# EAGLE design spielekonsole_schaltplan_03_05 (EAGLE 6.4)
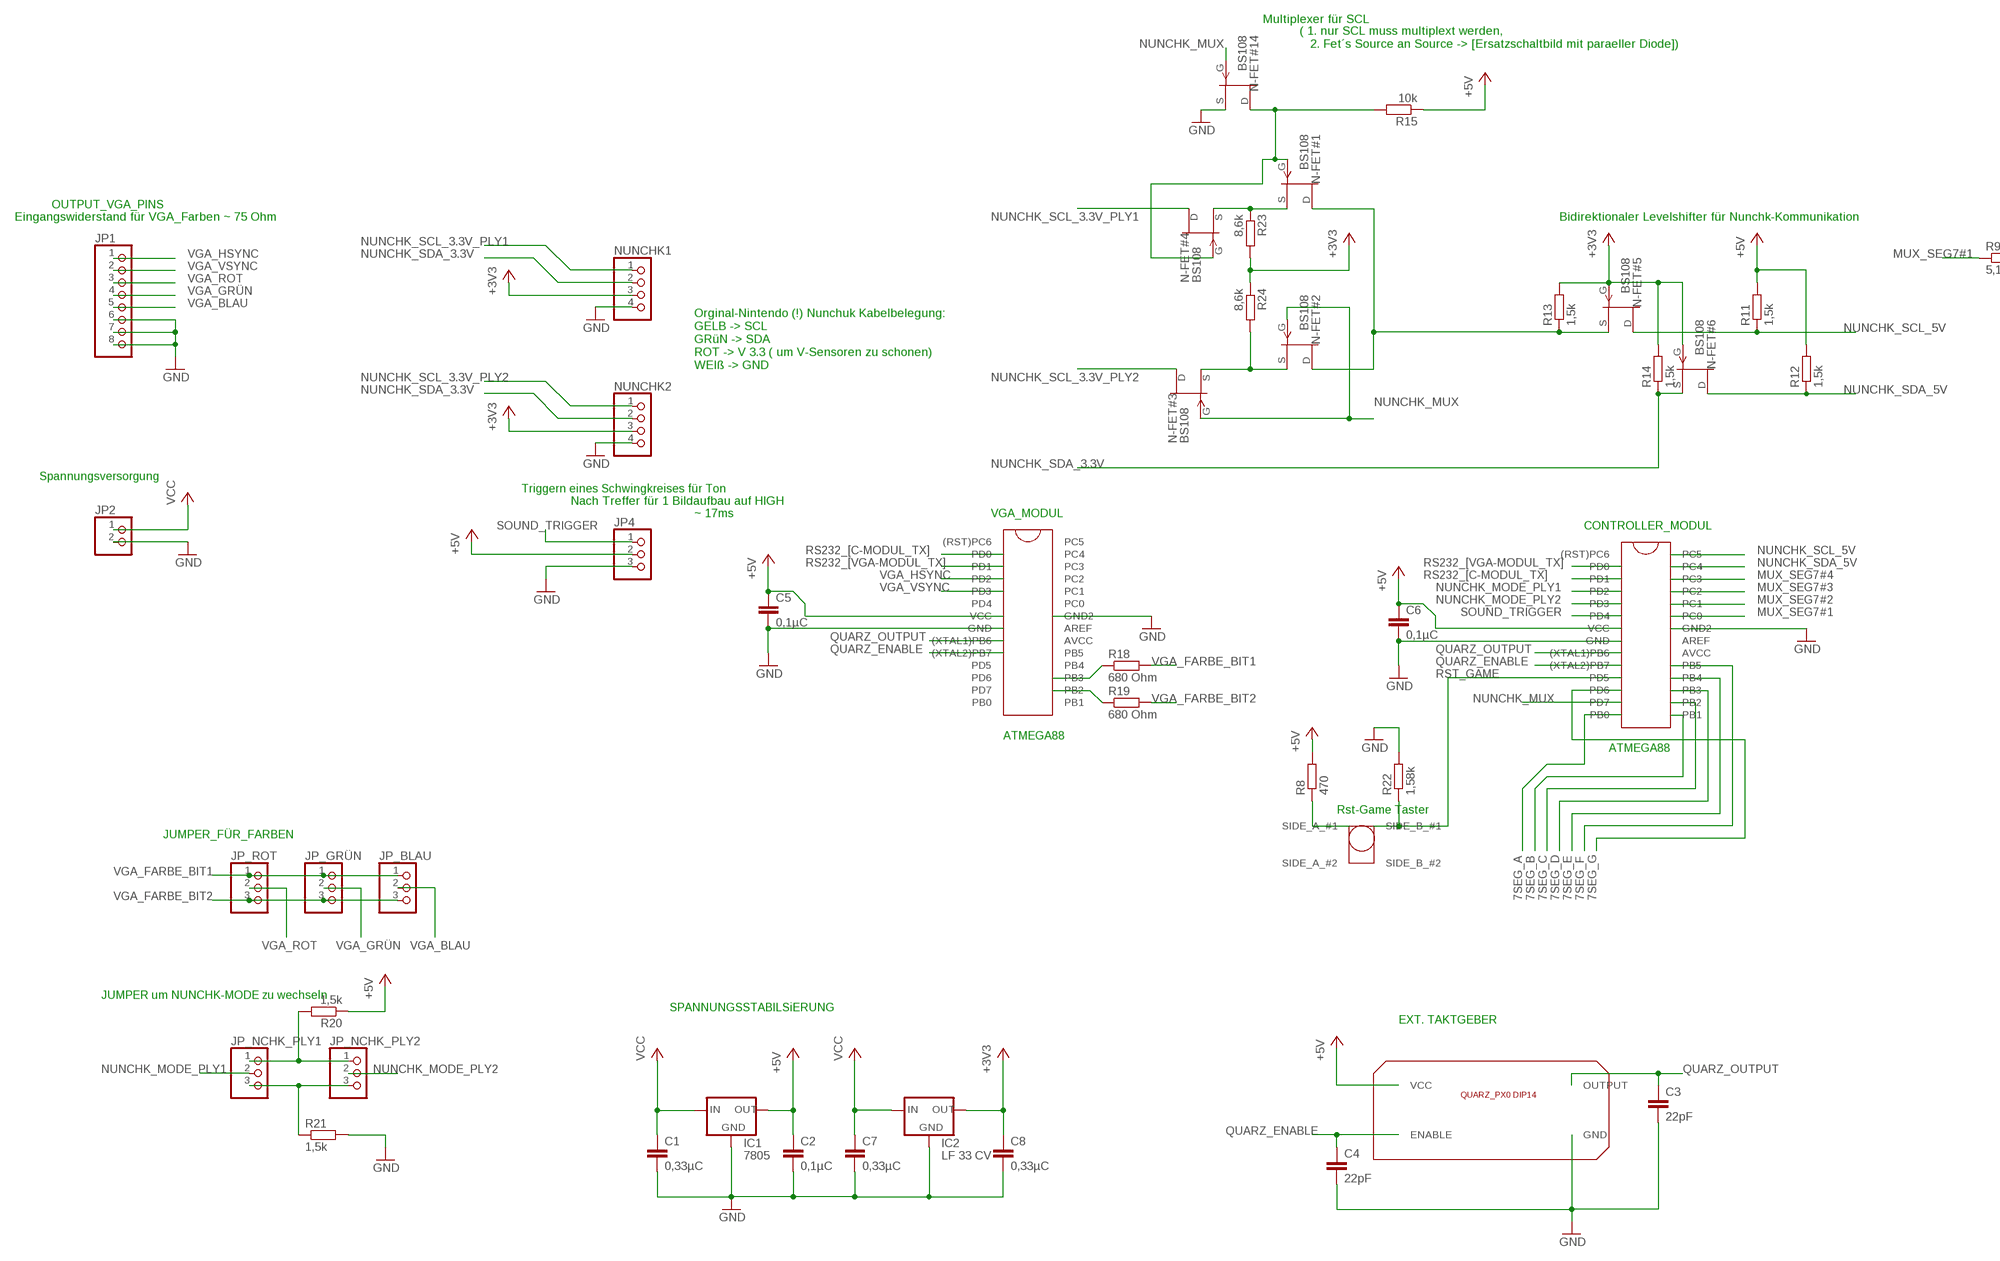
[diagram p0: schematic, sheet 1, part 1 of 2]
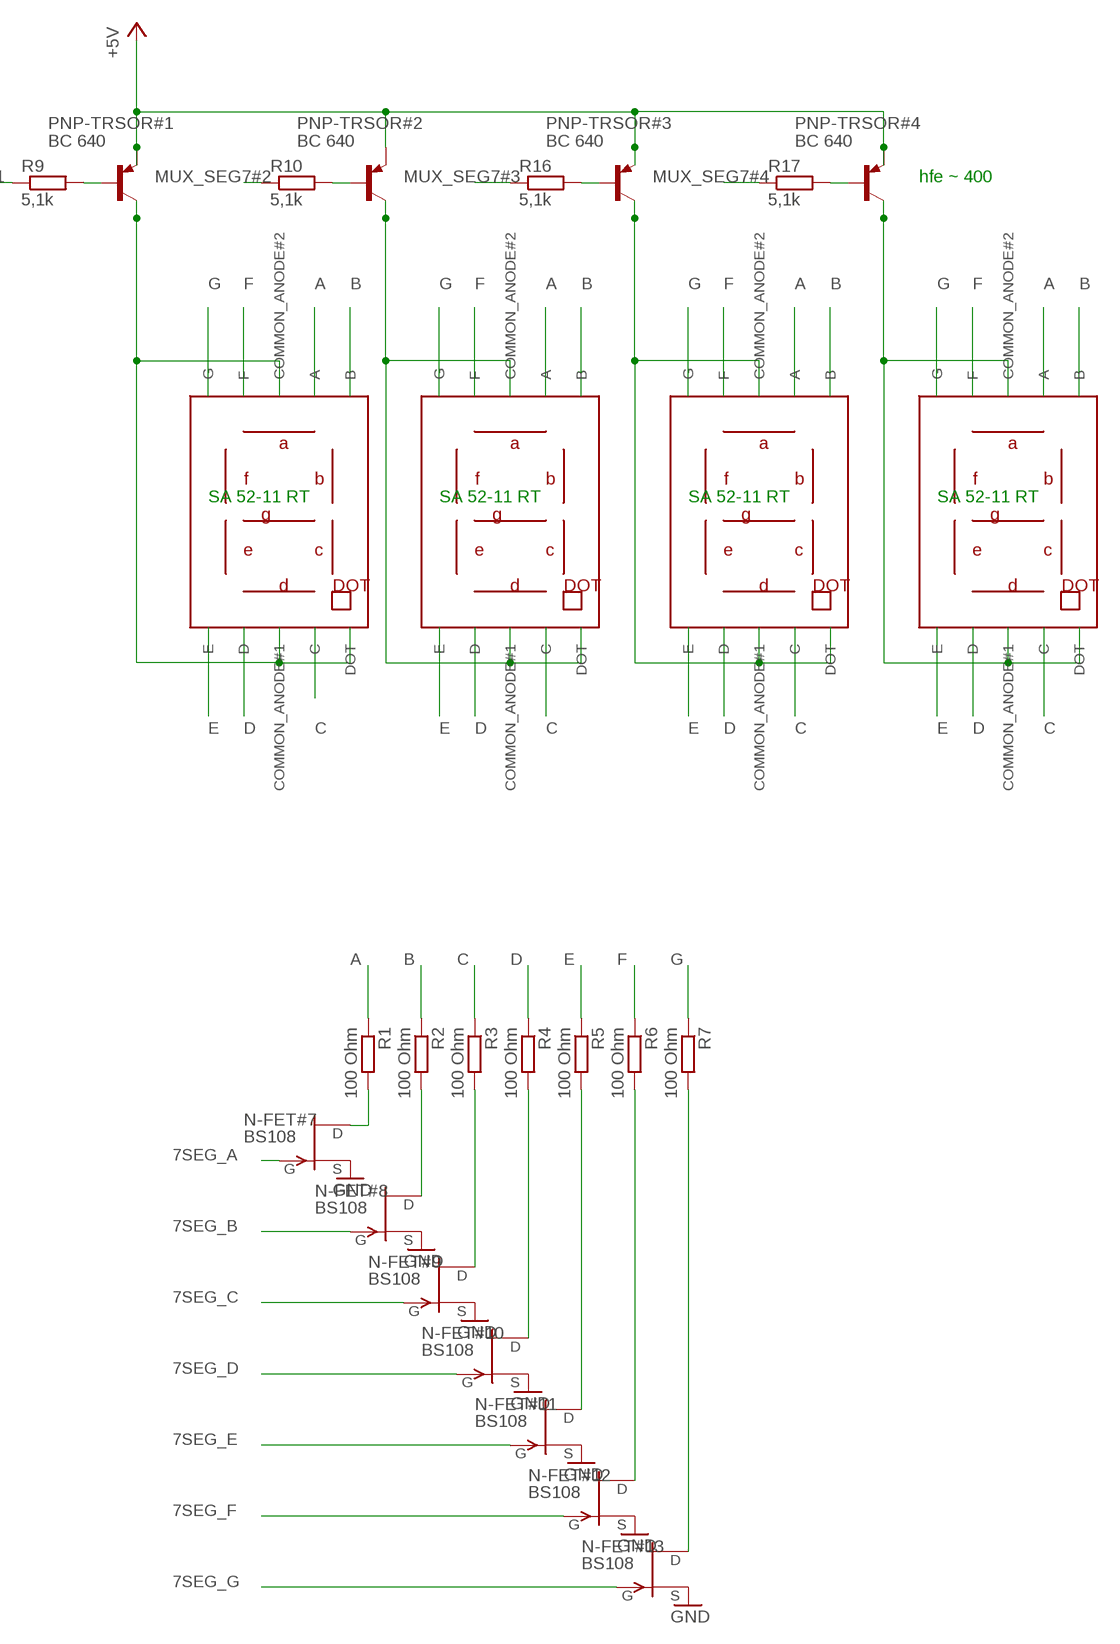
[diagram p1: schematic, sheet 1, part 2 of 2]

## Parts
C1  0,33µC  C-EU025-024X044  [C025-024X044]
C2  0,1µC  C-EU025-024X044  [C025-024X044]
C3  22pF  C-EU025-024X044  [C025-024X044]
C4  22pF  C-EU025-024X044  [C025-024X044]
C5  0,1µC  C-EU025-024X044  [C025-024X044]
C6  0,1µC  C-EU025-024X044  [C025-024X044]
C7  0,33µC  C-EU025-024X044  [C025-024X044]
C8  0,33µC  C-EU025-024X044  [C025-024X044]
IC1  7805  78XXL  [78XXL]
IC2  LF 33 CV  78XXL  [78XXL]
JP1  PINHD-1X8  [1X08]
JP2  PINHD-1X2  [1X02]
JP4  PINHD-1X3  [1X03]
JP_BLAU  PINHD-1X3  [1X03]
JP_GRÜN  PINHD-1X3  [1X03]
JP_NCHK_PLY1  PINHD-1X3  [1X03]
JP_NCHK_PLY2  PINHD-1X3  [1X03]
JP_ROT  PINHD-1X3  [1X03]
N-FET#1  BS108  2N3819  [TO92]
N-FET#2  BS108  2N3819  [TO92]
N-FET#3  BS108  2N3819  [TO92]
N-FET#4  BS108  2N3819  [TO92]
N-FET#5  BS108  2N3819  [TO92]
N-FET#6  BS108  2N3819  [TO92]
N-FET#7  BS108  2N3819  [TO92]
N-FET#8  BS108  2N3819  [TO92]
N-FET#9  BS108  2N3819  [TO92]
N-FET#10  BS108  2N3819  [TO92]
N-FET#11  BS108  2N3819  [TO92]
N-FET#12  BS108  2N3819  [TO92]
N-FET#13  BS108  2N3819  [TO92]
N-FET#14  BS108  2N3819  [TO92]
NUNCHK1  PINHD-1X4  [1X04]
NUNCHK2  PINHD-1X4  [1X04]
PNP-TRSOR#1  BC 640  2N4126  [TO92-CBE]
PNP-TRSOR#2  BC 640  2N4126  [TO92-CBE]
PNP-TRSOR#3  BC 640  2N4126  [TO92-CBE]
PNP-TRSOR#4  BC 640  2N4126  [TO92-CBE]
R1  100 Ohm  R-EU_0204/7  [0204/7]
R2  100 Ohm  R-EU_0204/7  [0204/7]
R3  100 Ohm  R-EU_0204/7  [0204/7]
R4  100 Ohm  R-EU_0204/7  [0204/7]
R5  100 Ohm  R-EU_0204/7  [0204/7]
R6  100 Ohm  R-EU_0204/7  [0204/7]
R7  100 Ohm  R-EU_0204/7  [0204/7]
R8  470  R-EU_0204/7  [0204/7]
R9  5,1k  R-EU_0204/7  [0204/7]
R10  5,1k  R-EU_0204/7  [0204/7]
R11  1,5k  R-EU_0204/7  [0204/7]
R12  1,5k  R-EU_0204/7  [0204/7]
R13  1,5k  R-EU_0204/7  [0204/7]
R14  1,5k  R-EU_0204/7  [0204/7]
R15  10k  R-EU_0204/7  [0204/7]
R16  5,1k  R-EU_0204/7  [0204/7]
R17  5,1k  R-EU_0204/7  [0204/7]
R18  680 Ohm  R-EU_0204/7  [0204/7]
R19  680 Ohm  R-EU_0204/7  [0204/7]
R20  1,5k  R-EU_0204/7  [0204/7]
R21  1,5k  R-EU_0204/7  [0204/7]
R22  1,58k  R-EU_0204/7  [0204/7]
R23  8,6k  R-EU_0204/7  [0204/7]
R24  8,6k  R-EU_0204/7  [0204/7]
U$1  ATMEGA 88-20 PU  ATMEGA8  [ATMEGA8_PAC]
U$2  ATMEGA 88-20 PU  ATMEGA8  [ATMEGA8_PAC]
U$3  QUARZ_PX0_DIP14  [QUARZ_PX0_DIP14_PAC]
U$4  SA 52-11 RT  SIEBEN_SEG_SA52-11  [SIEBEN_SEG_SA52-11_PAC]
U$5  SA 52-11 RT  SIEBEN_SEG_SA52-11  [SIEBEN_SEG_SA52-11_PAC]
U$6  SA 52-11 RT  SIEBEN_SEG_SA52-11  [SIEBEN_SEG_SA52-11_PAC]
U$7  SA 52-11 RT  SIEBEN_SEG_SA52-11  [SIEBEN_SEG_SA52-11_PAC]
U$8  TASTER_1  [TASTER_1_PAC]

## Nets
7SEG_A: N-FET#7.2(G) U$2.PB0
7SEG_B: N-FET#8.2(G) U$2.PB1
7SEG_C: N-FET#9.2(G) U$2.PB2
7SEG_D: N-FET#10.2(G) U$2.PB3
7SEG_E: N-FET#11.2(G) U$2.PB4
7SEG_F: N-FET#12.2(G) U$2.PB5
7SEG_G: N-FET#13.2(G) U$2.PD6
+3V3: C8.1 IC2.OUT N-FET#5.2(G) N-FET#6.2(G) NUNCHK1.3 NUNCHK2.3 R13.2 R14.2 R23.2 R24.1
+5V: C2.1 C5.1 C6.1 IC1.OUT JP4.2 PNP-TRSOR#1.E PNP-TRSOR#2.E PNP-TRSOR#3.E PNP-TRSOR#4.E R8.2 R11.2 R12.2 R15.1 R20.1 U$1.VCC U$2.VCC U$3.VCC
A: R1.1 U$4.A U$5.A U$6.A U$7.A
B: R2.1 U$4.B U$5.B U$6.B U$7.B
C: R3.1 U$4.C U$5.C U$6.C U$7.C
D: R4.1 U$4.D U$5.D U$6.D U$7.D
E: R5.1 U$4.E U$5.E U$6.E U$7.E
ENABLE_SEG7#1: PNP-TRSOR#1.C U$4.COMMON_ANODE#1 U$4.COMMON_ANODE#2 U$4.DOT
ENABLE_SEG7#2: PNP-TRSOR#2.C U$5.COMMON_ANODE#1 U$5.COMMON_ANODE#2 U$5.DOT
ENABLE_SEG7#3: PNP-TRSOR#3.C U$6.COMMON_ANODE#1 U$6.COMMON_ANODE#2 U$6.DOT
ENABLE_SEG7#4: PNP-TRSOR#4.C U$7.COMMON_ANODE#1 U$7.COMMON_ANODE#2 U$7.DOT
F: R6.1 U$4.F U$5.F U$6.F U$7.F
G: R7.1 U$4.G U$5.G U$6.G U$7.G
GND: C1.2 C2.2 C3.2 C4.2 C5.2 C6.2 C7.2 C8.2 IC1.GND IC2.GND JP1.6 JP1.7 JP1.8 JP2.2 JP4.3 N-FET#7.3(S) N-FET#8.3(S) N-FET#9.3(S) N-FET#10.3(S) N-FET#11.3(S) N-FET#12.3(S) N-FET#13.3(S) N-FET#14.3(S) NUNCHK1.4 NUNCHK2.4 R21.2 R22.2 U$1.GND1(GND) U$1.GND2 U$2.GND1(GND) U$2.GND2 U$3.GND
MUX_SEG7#1: R9.1 U$2.PC0
MUX_SEG7#2: R10.1 U$2.PC1
MUX_SEG7#3: R16.1 U$2.PC2
MUX_SEG7#4: R17.1 U$2.PC3
N$1: R8.1 U$8.SIDE_A_#1
N$2: PNP-TRSOR#1.B R9.2
N$3: PNP-TRSOR#2.B R10.2
N$4: PNP-TRSOR#3.B R16.2
N$5: PNP-TRSOR#4.B R17.2
N$6: R18.1 U$1.PB3
N$7: R19.1 U$1.PB2
N$8: JP_NCHK_PLY1.3 JP_NCHK_PLY2.3 R21.1
N$10: N-FET#1.2(G) N-FET#4.2(G) N-FET#14.1(D) R15.2
N$11: JP_NCHK_PLY1.1 JP_NCHK_PLY2.1 R20.2
N$12: N-FET#1.1(D) N-FET#2.1(D) N-FET#5.3(S) R13.1
N$13: N-FET#1.3(S) N-FET#4.3(S) R23.1
N$15: N-FET#2.3(S) N-FET#3.3(S) R24.2
N$18: N-FET#7.1(D) R1.2
N$19: N-FET#8.1(D) R2.2
N$20: N-FET#9.1(D) R3.2
N$21: N-FET#10.1(D) R4.2
N$22: N-FET#11.1(D) R5.2
N$23: N-FET#12.1(D) R6.2
N$24: N-FET#13.1(D) R7.2
NUNCHK_MODE_PLY1: JP_NCHK_PLY1.2 U$2.PD2
NUNCHK_MODE_PLY2: JP_NCHK_PLY2.2 U$2.PD3
NUNCHK_MUX: N-FET#2.2(G) N-FET#3.2(G) N-FET#14.2(G) U$2.PD7
NUNCHK_SCL_3.3V_PLY1: N-FET#4.1(D) NUNCHK1.1
NUNCHK_SCL_3.3V_PLY2: N-FET#3.1(D) NUNCHK2.1
NUNCHK_SCL_5V: N-FET#5.1(D) R11.1 U$2.PC5
NUNCHK_SDA_3.3V: N-FET#6.3(S) NUNCHK1.2 NUNCHK2.2 R14.1
NUNCHK_SDA_5V: N-FET#6.1(D) R12.1 U$2.PC4
QUARZ_ENABLE: C4.1 U$1.PB7((XTAL2)PB7) U$2.PB7((XTAL2)PB7) U$3.ENABLE
QUARZ_OUTPUT: C3.1 U$1.PB6((XTAL1)PB6) U$2.PB6((XTAL1)PB6) U$3.OUTPUT
RS232_[C-MODUL_TX]: U$1.PD0 U$2.PD1
RS232_[VGA-MODUL_TX]: U$1.PD1 U$2.PD0
RST_GAME: R22.1 U$2.PD5 U$8.SIDE_B_#1
SOUND_TRIGGER: JP4.1 U$2.PD4
VCC: C1.1 C7.1 IC1.IN IC2.IN JP2.1
VGA_BLAU: JP1.5 JP_BLAU.2
VGA_FARBE_BIT1: JP_BLAU.1 JP_GRÜN.1 JP_ROT.1 R18.2
VGA_FARBE_BIT2: JP_BLAU.3 JP_GRÜN.3 JP_ROT.3 R19.2
VGA_GRÜN: JP1.4 JP_GRÜN.2
VGA_HSYNC: JP1.1 U$1.PD2
VGA_ROT: JP1.3 JP_ROT.2
VGA_VSYNC: JP1.2 U$1.PD3
Unconnected: U$1.AREF U$1.AVCC U$1.PB0 U$1.PB1 U$1.PB4 U$1.PB5 U$1.PC0 U$1.PC1 U$1.PC2 U$1.PC3 U$1.PC4 U$1.PC5 U$1.PC6((RST)PC6) U$1.PD4 U$1.PD5 U$1.PD6 U$1.PD7 U$2.AREF U$2.AVCC U$2.PC6((RST)PC6) U$8.SIDE_A_#2 U$8.SIDE_B_#2

## Notes on the sheet
- Multiplexer für SCL
- ( 1. nur SCL muss multiplext werden,
     2. Fet´s Source an Source -> [Ersatzschaltbild mit paraeller Diode])
- OUTPUT_VGA_PINS
- Eingangswiderstand für VGA_Farben ~ 75 Ohm | Bidirektionaler Levelshifter für Nunchk-Kommunikation
- hfe ~ 400
- Orginal-Nintendo (!) Nunchuk Kabelbelegung:
  GELB -> SCL
  GRüN -> SDA
  ROT -> V 3.3 ( um V-Sensoren zu schonen)
  WEIß -> GND
- Spannungsversorgung | SA 52-11 RT | SA 52-11 RT | SA 52-11 RT | SA 52-11 RT
- Triggern eines Schwingkreises für Ton
- Nach Treffer für 1 Bildaufbau auf HIGH
- ~ 17ms | VGA_MODUL
- CONTROLLER_MODUL
- ATMEGA88
- ATMEGA88
- Rst-Game Taster
- JUMPER_FÜR_FARBEN
- JUMPER um NUNCHK-MODE zu wechseln
- SPANNUNGSSTABILSiERUNG
- EXT. TAKTGEBER

## Library data of the parts
C1-C8 = rcl:C-EU: CAPACITOR, European symbol
IC1 IC2 = v-reg:78XXL: VOLTAGE REGULATOR
JP1 = pinhead:PINHD-1X8: PIN HEADER
JP2 = pinhead:PINHD-1X2: PIN HEADER
JP4 JP_BLAU JP_GRÜN JP_NCHK_PLY1 JP_NCHK_PLY2 JP_ROT = pinhead:PINHD-1X3: PIN HEADER
N-FET#1-N-FET#14 = transistor-fet:2N3819: N-Channel Junction FET
NUNCHK1 NUNCHK2 = pinhead:PINHD-1X4: PIN HEADER
PNP-TRSOR#1-PNP-TRSOR#4 = transistor-pnp:2N4126*: PNP Transistror
R1-R24 = rcl:R-EU_: RESISTOR, European symbol
U$1 U$2 = MyLib:ATMEGA8
U$3 = MyLib:QUARZ_PX0_DIP14
U$4-U$7 = MyLib:SIEBEN_SEG_SA52-11
U$8 = MyLib:TASTER_1

## Board
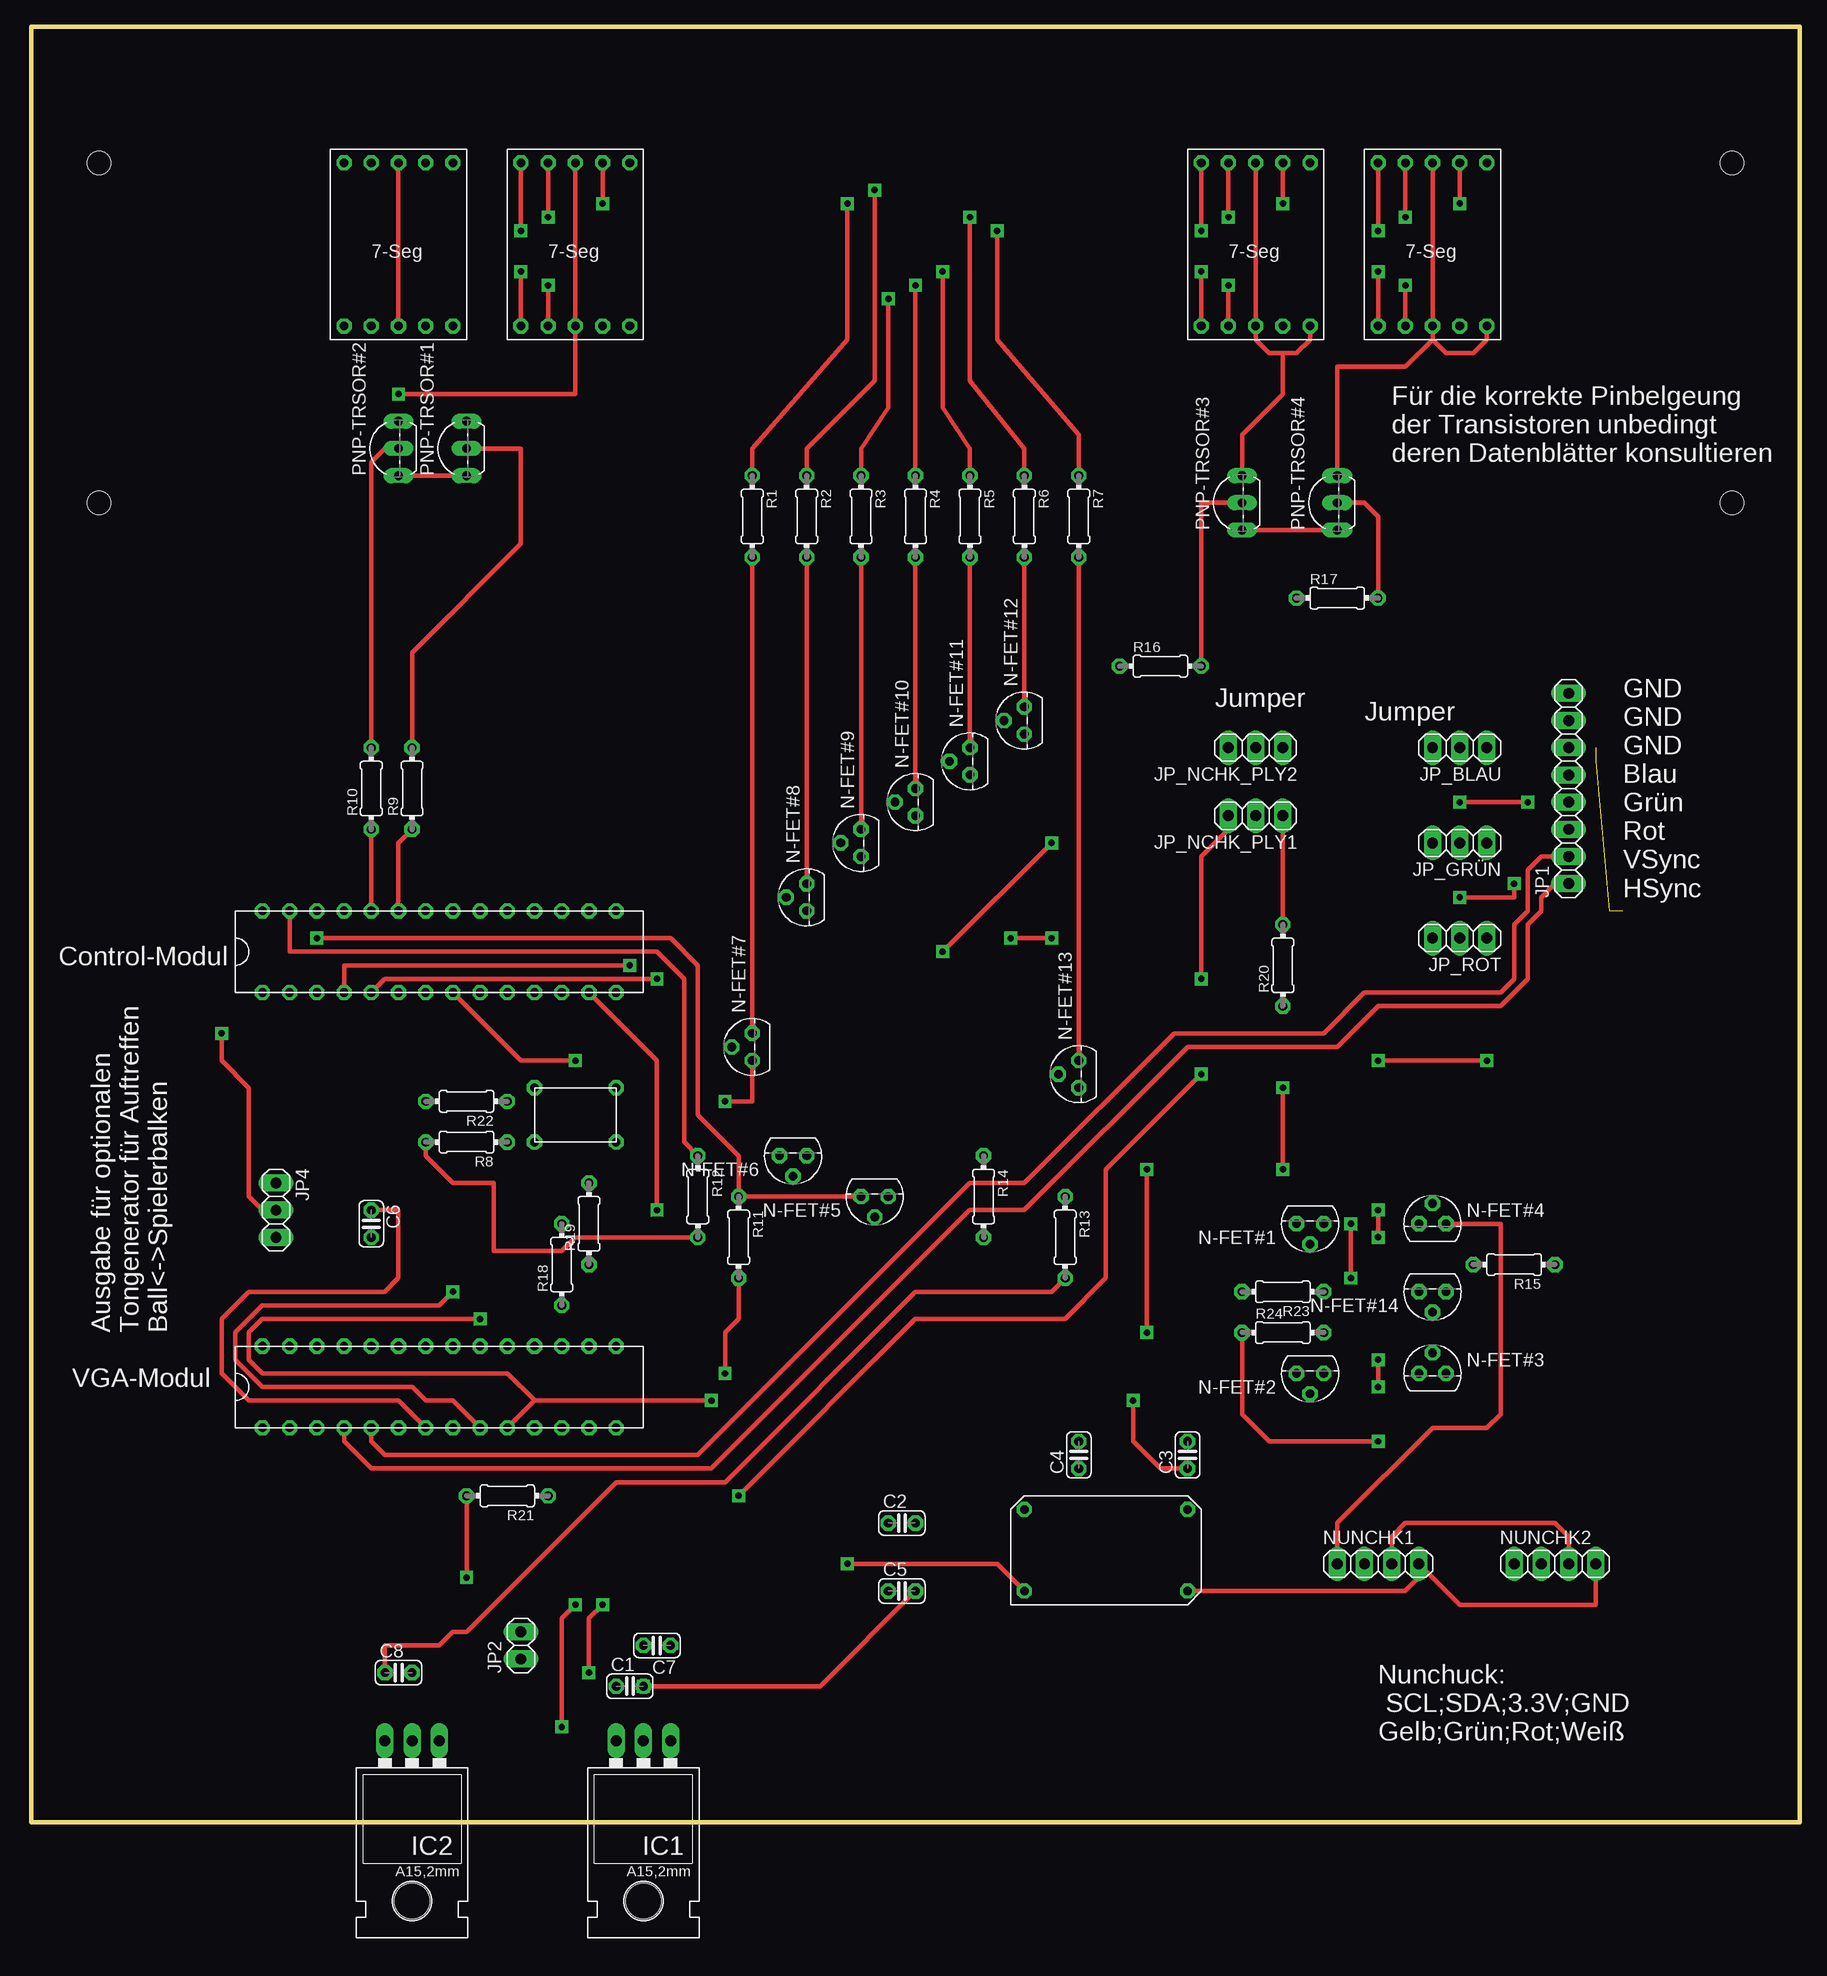
[diagram p2: board, top side]
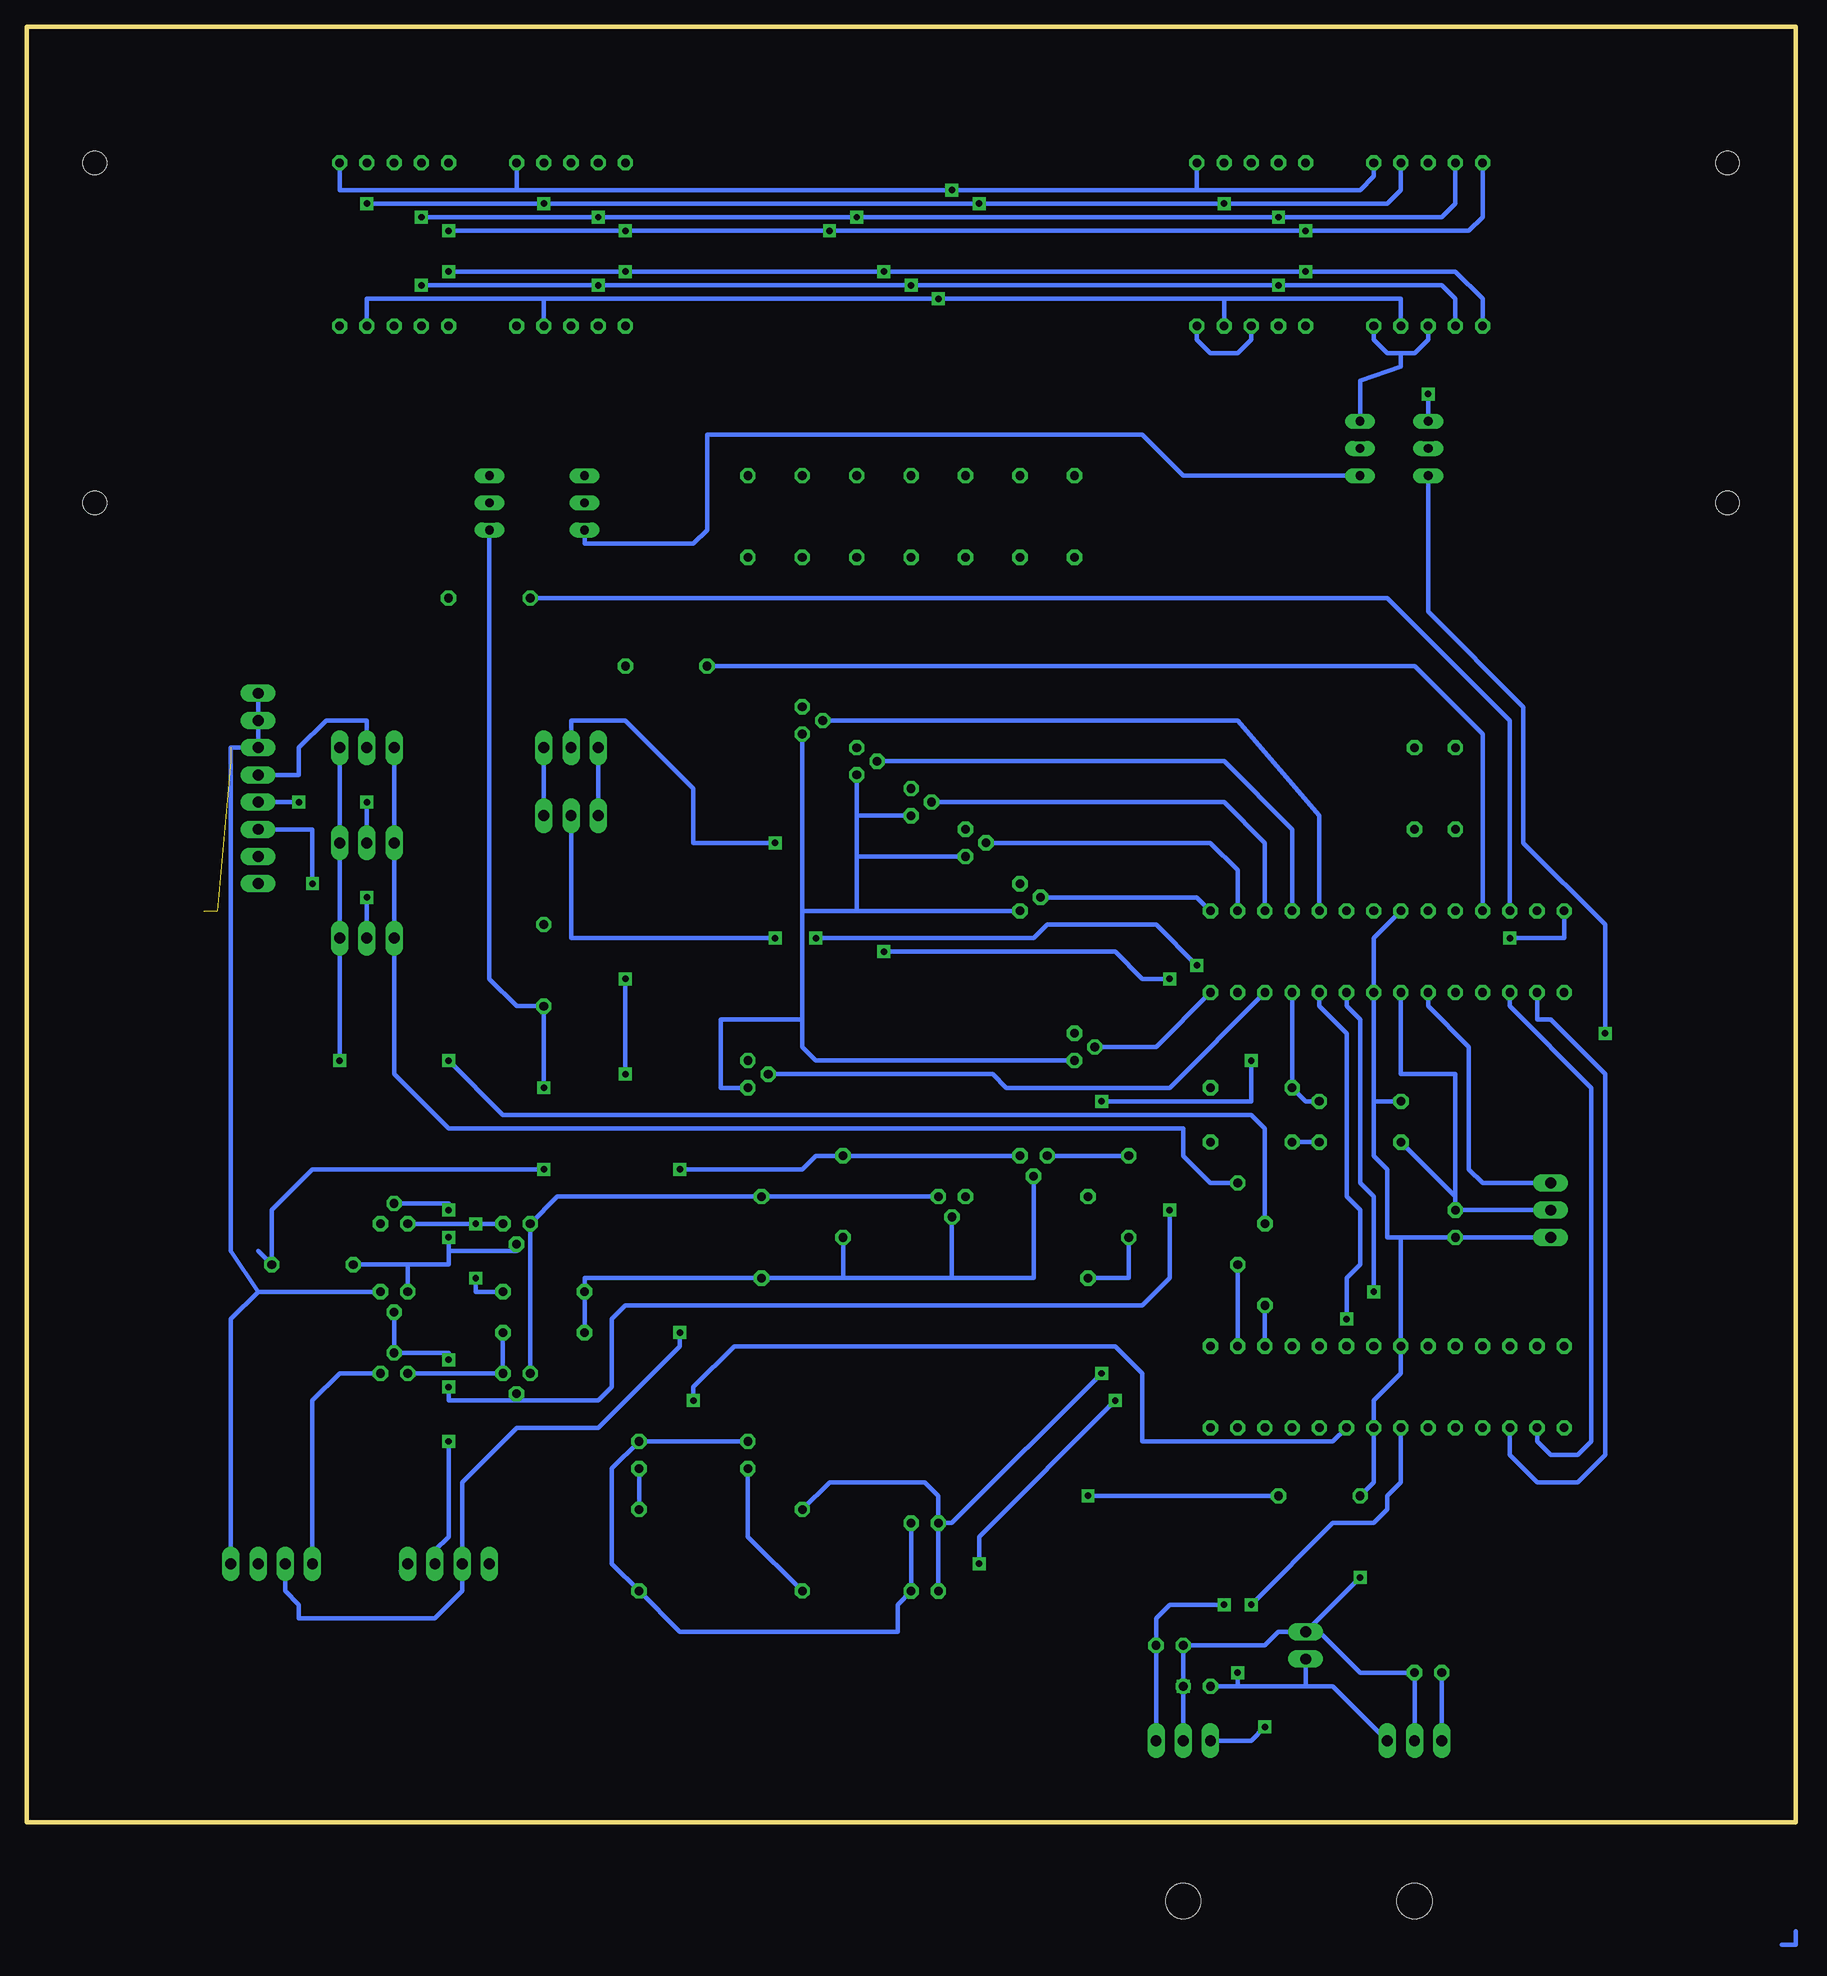
[diagram p3: board, bottom side, seen from below]

Size 165.1 x 167.64 mm. Coordinates in mm from the lower left corner, seen from the top.
Outline: 0,0 0,167.64 165.1,167.64 165.1,0 0,0
Copper layers (1*16): Top 0.035mm / dielectric 1.5mm / Bottom 0.035mm
Design rules "default *": minimum track width 12mil, minimum drill 19mil, track to track 12mil, track to pad 12mil, pad to pad 12mil, via to via 12mil, smd to smd 12mil, copper to edge 40mil, drill to drill 12mil, minimum pad ring 12mil, minimum via ring 12mil, stop-mask expansion 4mil, vias tented up to drill 0mil, thermal gap 10mil
Holes 2.2 mm at 6.35,154.94 158.75,154.94 6.35,123.19 158.75,123.19

### Footprints (pad centres in the part's own frame; a part is rotated, then mirrored left to right if it is on the bottom)
C025-024X044 = drill 0.813 octagon: 1 -1.27,0; 2 1.27,0
78XXL = drill 1.016 long: GND 0,-3.81; IN -2.54,-3.81; OUT 2.54,-3.81 | hole 3.302: 0,11.176
1X08 = drill 1.016 long: 1 -8.89,0; 2 -6.35,0; 3 -3.81,0; 4 -1.27,0; 5 1.27,0; 6 3.81,0; 7 6.35,0; 8 8.89,0
1X02 = drill 1.016 long: 1 -1.27,0; 2 1.27,0
1X03 = drill 1.016 long: 1 -2.54,0; 2 0,0; 3 2.54,0
TO92 = drill 0.813 octagon: 1 1.27,0; 2 0,1.905; 3 -1.27,0
1X04 = drill 1.016 long: 1 -3.81,0; 2 -1.27,0; 3 1.27,0; 4 3.81,0
TO92-CBE = drill 0.813 long: B 0,0; C 2.54,0; E -2.54,0
0204/7 = drill 0.813 octagon: 1 -3.81,0; 2 3.81,0
ATMEGA8_PAC = drill 0.8 octagon: AREF 3.81,-2.54; AVCC 3.81,-5.08; GND1 -3.81,-2.54; GND2 3.81,0; PB0 -3.81,-17.78; PB1 3.81,-17.78; PB2 3.81,-15.24; PB3 3.81,-12.7; PB4 3.81,-10.16; PB5 3.81,-7.62; PB6 -3.81,-5.08; PB7 -3.81,-7.62; PC0 3.81,2.54; PC1 3.81,5.08; PC2 3.81,7.62; PC3 3.81,10.16; PC4 3.81,12.7; PC5 3.81,15.24; PC6 -3.81,15.24; PD0 -3.81,12.7; PD1 -3.81,10.16; PD2 -3.81,7.62; PD3 -3.81,5.08; PD4 -3.81,2.54; PD5 -3.81,-10.16; PD6 -3.81,-12.7; PD7 -3.81,-15.24; VCC -3.81,0
QUARZ_PX0_DIP14_PAC = drill 0.8 octagon: ENABLE -7.62,-3.81; GND 7.62,-3.81; OUTPUT 7.62,3.81; VCC -7.62,3.81
SIEBEN_SEG_SA52-11_PAC = drill 0.8 octagon: A 2.54,6.35; B 5.08,6.35; C 2.54,-8.89; COMMON_ANODE#1 0,-8.89; COMMON_ANODE#2 0,6.35; D -2.54,-8.89; DOT 5.08,-8.89; E -5.08,-8.89; F -2.54,6.35; G -5.08,6.35
TASTER_1_PAC = drill 0.8 octagon: SIDE_A_#1 -3.81,-2.54; SIDE_A_#2 3.81,-2.54; SIDE_B_#1 -3.81,2.54; SIDE_B_#2 3.81,2.54

### Placement (x,y rotation side)
C1  55.88,12.7 0 top
C2  81.28,27.94 0 top
C3  107.95,34.29 90 top
C4  97.79,34.29 90 top
C5  81.28,21.59 0 top
C6  31.75,55.88 270 top
C7  58.42,16.51 180 top
C8  34.29,13.97 0 top
IC1  57.15,3.81 180 top
IC2  35.56,3.81 180 top
JP1  143.51,96.52 90 top
JP2  45.72,16.51 90 top
JP4  22.86,57.15 270 top
JP_BLAU  133.35,100.33 180 top
JP_GRÜN  133.35,91.44 180 top
JP_NCHK_PLY1  114.3,93.98 180 top
JP_NCHK_PLY2  114.3,100.33 180 top
JP_ROT  133.35,82.55 180 top
N-FET#1  119.38,55.88 180 top
N-FET#2  119.38,41.91 180 top
N-FET#3  130.81,41.91 0 top
N-FET#4  130.81,55.88 0 top
N-FET#5  78.74,58.42 180 top
N-FET#6  71.12,62.23 180 top
N-FET#7  67.31,72.39 90 top
N-FET#8  72.39,86.36 90 top
N-FET#9  77.47,91.44 90 top
N-FET#10  82.55,95.25 90 top
N-FET#11  87.63,99.06 90 top
N-FET#12  92.71,102.87 90 top
N-FET#13  97.79,69.85 90 top
N-FET#14  130.81,49.53 180 top
NUNCHK1  125.73,24.13 0 top
NUNCHK2  142.24,24.13 0 top
PNP-TRSOR#1  40.64,128.27 90 top
PNP-TRSOR#2  34.29,128.27 90 top
PNP-TRSOR#3  113.03,123.19 90 top
PNP-TRSOR#4  121.92,123.19 90 top
R1  67.31,121.92 270 top
R2  72.39,121.92 270 top
R3  77.47,121.92 270 top
R4  82.55,121.92 270 top
R5  87.63,121.92 270 top
R6  92.71,121.92 270 top
R7  97.79,121.92 270 top
R8  40.64,63.5 180 top
R9  35.56,96.52 90 top
R10  31.75,96.52 90 top
R11  66.04,54.61 270 top
R12  62.23,58.42 270 top
R13  96.52,54.61 270 top
R14  88.9,58.42 270 top
R15  138.43,52.07 180 top
R16  105.41,107.95 0 top
R17  121.92,114.3 0 top
R18  49.53,52.07 90 top
R19  52.07,55.88 90 top
R20  116.84,80.01 90 top
R21  44.45,30.48 180 top
R22  40.64,67.31 180 top
R23  116.84,49.53 180 top
R24  116.84,45.72 0 top
U$1  36.83,40.64 90 top
U$2  36.83,81.28 90 top
U$3  100.33,25.4 0 top
U$4  34.29,148.59 0 top
U$5  50.8,148.59 0 top
U$6  114.3,148.59 0 top
U$7  130.81,148.59 0 top
U$8  50.8,66.04 0 top

### Tracks (layer width: path | path; a pad name or v marks a point on that pad's centre or on a via)
7SEG_A
  Bottom 0.406: N-FET#7.2 59.69,72.39 U$2.PB0
7SEG_B
  Bottom 0.406: N-FET#8.2 55.88,86.36 U$2.PB1
7SEG_C
  Bottom 0.406: N-FET#9.2 54.61,91.44 52.07,88.9 U$2.PB2
7SEG_D
  Bottom 0.406: N-FET#10.2 53.34,95.25 49.53,91.44 U$2.PB3
7SEG_E
  Bottom 0.406: N-FET#11.2 53.34,99.06 46.99,92.71 U$2.PB4
7SEG_F
  Bottom 0.406: N-FET#12.2 52.07,102.87 44.45,93.98 U$2.PB5
7SEG_G
  Bottom 0.406: N-FET#13.2 74.93,69.85 73.66,68.58 58.42,68.58 U$2.PD6
+3V3  (via drill 0.6)
  Top 0.406: NUNCHK1.3 127,26.67 128.27,27.94 142.24,27.94 143.51,26.67 NUNCHK2.3 | C8.1 33.02,16.51 38.1,16.51 39.37,17.78 40.64,17.78 54.61,31.75 64.77,31.75 82.55,49.53 95.25,49.53 R13.2 | R24.1 113.03,38.1 115.57,35.56 v125.73,35.56
  Bottom 0.406: IC2.OUT C8.1 | N-FET#6.2 71.12,50.8 78.74,50.8 | 78.74,50.8 N-FET#5.2 | R24.1 R23.2 113.03,50.8 R13.2 88.9,50.8 | 88.9,50.8 78.74,50.8 | R14.2 88.9,50.8 | v125.73,35.56 125.73,26.67 127,25.4 NUNCHK1.3
+5V  (via drill 0.6)
  Top 0.406: v49.53,8.89 49.53,19.05 v50.8,20.32 | PNP-TRSOR#3.E PNP-TRSOR#4.E | PNP-TRSOR#2.E PNP-TRSOR#1.E | C6.1 34.29,57.15 34.29,50.8 33.02,49.53 20.32,49.53 17.78,46.99 17.78,41.91 20.32,39.37 34.29,39.37 U$1.VCC | R8.2 36.83,62.23 39.37,59.69 43.18,59.69 43.18,53.34 49.53,53.34 50.8,54.61 R12.2 | v116.84,60.96 v116.84,68.58 | R11.2 66.04,46.99 64.77,45.72 v64.77,41.91 | v17.78,73.66 17.78,71.12 20.32,68.58 20.32,58.42 21.59,57.15 JP4.2
  Bottom 0.406: IC1.OUT 50.8,7.62 v49.53,8.89 | PNP-TRSOR#1.E 57.15,125.73 60.96,129.54 101.6,129.54 101.6,120.65 102.87,119.38 113.03,119.38 PNP-TRSOR#3.E | C5.1 C2.1 | C2.1 80.01,30.48 81.28,31.75 90.17,31.75 U$3.VCC | R11.2 62.23,50.8 R12.2 | 143.51,53.34 R15.1 142.24,57.15 138.43,60.96 v116.84,60.96 | U$2.VCC 36.83,69.85 31.75,69.85 C6.1 | JP4.2 C6.1 | C6.1 31.75,58.42 R8.2 | PNP-TRSOR#2.E 34.29,113.03 25.4,104.14 25.4,91.44 17.78,83.82 v17.78,73.66 | U$1.VCC 36.83,31.75 38.1,30.48 38.1,29.21 39.37,27.94 43.18,27.94 v50.8,20.32 | v116.84,68.58 R20.1 119.38,76.2 121.92,78.74 PNP-TRSOR#4.E | v64.77,41.91 78.74,27.94 C2.1
A  (via drill 0.6)
  Top 0.406: U$5.A v53.34,151.13 | U$6.A v116.84,151.13 | U$7.A v133.35,151.13 | v76.2,151.13 76.2,138.43 67.31,128.27 R1.1
  Bottom 0.406: U$4.A 36.83,152.4 38.1,151.13 v53.34,151.13 v76.2,151.13 v116.84,151.13 v133.35,151.13
B  (via drill 0.6)
  Top 0.406: v78.74,152.4 78.74,134.62 72.39,128.27 R2.1
  Bottom 0.406: 119.38,153.67 U$6.B 119.38,152.4 | 55.88,152.4 40.64,152.4 39.37,153.67 U$4.B | U$5.B 55.88,152.4 | U$7.B 135.89,152.4 119.38,152.4 | 55.88,152.4 v78.74,152.4 119.38,152.4
C  (via drill 0.6)
  Top 0.406: R3.1 77.47,128.27 80.01,132.08 v80.01,142.24
  Bottom 0.406: U$4.C 36.83,142.24 53.34,142.24 | U$5.C 53.34,142.24 | U$7.C 133.35,142.24 116.84,142.24 | 53.34,142.24 v80.01,142.24 116.84,142.24 | U$6.C 116.84,142.24
D  (via drill 0.6)
  Top 0.406: U$5.D v48.26,143.51 | U$7.D v128.27,143.51 | U$6.D v111.76,143.51 | R4.1 v82.55,143.51
  Bottom 0.406: U$4.D 31.75,142.24 33.02,143.51 v48.26,143.51 v82.55,143.51 v111.76,143.51 v128.27,143.51
E  (via drill 0.6)
  Top 0.406: U$5.E v45.72,144.78 | U$7.E v125.73,144.78 | U$6.E v109.22,144.78 | R5.1 87.63,128.27 85.09,132.08 v85.09,144.78
  Bottom 0.406: U$4.E 29.21,142.24 31.75,144.78 v45.72,144.78 v85.09,144.78 v109.22,144.78 v125.73,144.78
ENABLE_SEG7#1
  Top 0.406: U$4.COMMON_ANODE#2 U$4.COMMON_ANODE#1
  Bottom 0.406: U$4.DOT 39.37,138.43 38.1,137.16 36.83,137.16 | 36.83,137.16 35.56,137.16 34.29,138.43 U$4.COMMON_ANODE#1 | PNP-TRSOR#1.C 40.64,134.62 36.83,135.89 36.83,137.16
ENABLE_SEG7#2  (via drill 0.6)
  Top 0.406: U$5.COMMON_ANODE#2 U$5.COMMON_ANODE#1 50.8,133.35 v34.29,133.35
  Bottom 0.406: U$5.COMMON_ANODE#1 50.8,138.43 52.07,137.16 54.61,137.16 55.88,138.43 U$5.DOT | PNP-TRSOR#2.C v34.29,133.35
ENABLE_SEG7#3
  Top 0.406: U$6.COMMON_ANODE#2 U$6.COMMON_ANODE#1 114.3,138.43 115.57,137.16 116.84,137.16 | U$6.DOT 119.38,138.43 118.11,137.16 116.84,137.16 | PNP-TRSOR#3.C 113.03,129.54 116.84,133.35 116.84,137.16
ENABLE_SEG7#4
  Top 0.406: U$7.COMMON_ANODE#2 U$7.COMMON_ANODE#1 130.81,138.43 | U$7.DOT 135.89,138.43 134.62,137.16 132.08,137.16 130.81,138.43 | PNP-TRSOR#4.C 121.92,135.89 128.27,135.89 130.81,138.43
F  (via drill 0.6)
  Top 0.406: U$5.F v48.26,149.86 | U$6.F v111.76,149.86 | U$7.F v128.27,149.86 | v87.63,149.86 87.63,134.62 92.71,128.27 R6.1
  Bottom 0.406: U$4.F 31.75,151.13 33.02,149.86 v48.26,149.86 v87.63,149.86 v111.76,149.86 v128.27,149.86
G  (via drill 0.6)
  Top 0.406: U$5.G v45.72,148.59 | U$6.G v109.22,148.59 | U$7.G v125.73,148.59 | v90.17,148.59 90.17,138.43 97.79,129.54 R7.1
  Bottom 0.406: U$4.G 29.21,149.86 30.48,148.59 v45.72,148.59 v90.17,148.59 v109.22,148.59 v125.73,148.59
GND  (via drill 0.6)  (3 unrouted)
  Top 0.406: NUNCHK1.4 130.18,23.5 | 130.18,23.5 133.35,20.32 146.05,20.32 NUNCHK2.4 | R21.2 v40.64,22.86 | C1.2 73.66,12.7 C5.2 | 130.18,23.5 128.27,21.59 U$3.GND | N-FET#7.3 67.31,67.31 v64.77,67.31 | v50.8,71.12 45.72,71.12 U$2.GND1
  Bottom 0.406: IC1.GND C1.2 C7.2 49.53,16.51 48.26,17.78 JP2.2 | JP2.2 44.45,17.78 40.64,13.97 C8.2 IC2.GND | N-FET#11.3 87.63,93.98 | 87.63,93.98 87.63,90.17 | 87.63,90.17 87.63,85.09 | 92.71,85.09 92.71,74.93 | 92.71,74.93 92.71,72.39 91.44,71.12 N-FET#7.3 | N-FET#10.3 87.63,93.98 | N-FET#9.3 87.63,90.17 | N-FET#8.3 87.63,85.09 | N-FET#12.3 92.71,85.09 | 92.71,85.09 87.63,85.09 | N-FET#13.3 100.33,68.58 100.33,74.93 92.71,74.93 | U$2.GND2 39.37,82.55 U$2.GND1 39.37,67.31 | C2.2 C5.2 83.82,20.32 83.82,17.78 104.14,17.78 U$3.GND 110.49,24.13 110.49,33.02 C3.2 C4.2 | N-FET#14.3 143.51,49.53 | 39.37,67.31 39.37,62.23 38.1,60.96 38.1,54.61 36.83,54.61 | 143.51,49.53 146.05,53.34 146.05,100.33 JP1.6 JP1.7 JP1.8 | NUNCHK2.4 146.05,46.99 143.51,49.53 | R22.2 39.37,67.31 | JP4.3 C6.2 36.83,54.61 | 36.83,54.61 U$1.GND2 36.83,41.91 39.37,39.37 U$1.GND1 39.37,31.75 R21.2 | v40.64,22.86 JP2.2 | 130.18,23.5 NUNCHK1.4 | v64.77,67.31 50.8,67.31 v50.8,71.12
  other vias: 57.15,12.7
MUX_SEG7#1
  Top 0.406: U$2.PC0 34.29,91.44 R9.1
MUX_SEG7#2
  Top 0.406: R10.1 U$2.PC1
MUX_SEG7#3
  Bottom 0.406: R16.1 35.56,107.95 29.21,101.6 U$2.PC2
MUX_SEG7#4
  Bottom 0.406: R17.1 38.1,114.3 26.67,102.87 U$2.PC3
N$1
  Bottom 0.406: R8.1 U$8.SIDE_A_#1
N$2
  Top 0.406: PNP-TRSOR#1.B 45.72,128.27 45.72,119.38 35.56,109.22 R9.2
N$3
  Top 0.406: PNP-TRSOR#2.B 33.02,128.27 31.75,127 R10.2
N$4
  Top 0.406: PNP-TRSOR#3.B 109.22,123.19 R16.2
N$5
  Top 0.406: PNP-TRSOR#4.B 124.46,123.19 125.73,121.92 R17.2
N$6
  Bottom 0.406: U$1.PB3 R18.1
N$7
  Bottom 0.406: U$1.PB2 R19.1
N$8  (via drill 0.6)
  Top 0.406: v66.04,30.48 82.55,46.99 96.52,46.99 100.33,50.8 100.33,60.96 v109.22,69.85 | v109.22,78.74 109.22,90.17 111.76,92.71 JP_NCHK_PLY1.3
  Bottom 0.406: JP_NCHK_PLY2.3 JP_NCHK_PLY1.3 | R21.1 v66.04,30.48 | v109.22,69.85 v109.22,78.74
N$10  (via drill 0.6)
  Top 0.406: v125.73,57.15 v125.73,54.61
  Bottom 0.406: N-FET#4.2 125.73,57.78 v125.73,57.15 | v125.73,54.61 125.73,53.34 | 125.73,53.34 119.38,53.34 N-FET#1.2 | N-FET#14.1 129.54,52.07 | 129.54,52.07 R15.2 | 129.54,52.07 125.73,52.07 125.73,53.34
N$11
  Top 0.406: JP_NCHK_PLY1.1 R20.2
  Bottom 0.406: JP_NCHK_PLY1.1 JP_NCHK_PLY2.1
N$12
  Bottom 0.406: N-FET#5.3 R13.1 115.57,58.42 N-FET#1.1 N-FET#2.1
N$13  (via drill 0.6)
  Top 0.406: v123.19,50.8 v123.19,55.88
  Bottom 0.406: R23.1 123.19,49.53 v123.19,50.8 | N-FET#1.3 v123.19,55.88 N-FET#4.3
N$14
  Bottom 0.406: 1.27,-11.43 0,-11.43 0,-10.16
N$15
  Bottom 0.406: N-FET#3.3 N-FET#2.3 R24.2
N$18
  Top 0.406: N-FET#7.1 R1.2
N$19
  Top 0.406: N-FET#8.1 R2.2
N$20
  Top 0.406: N-FET#9.1 R3.2
N$21
  Top 0.406: N-FET#10.1 R4.2
N$22
  Top 0.406: N-FET#11.1 R5.2
N$23
  Top 0.406: N-FET#12.1 R6.2
N$24
  Top 0.406: N-FET#13.1 R7.2
NUNCHK_MODE_PLY1  (via drill 0.6)
  Top 0.406: U$2.PD2 29.21,80.01 v55.88,80.01 | v91.44,82.55 v95.25,82.55
  Bottom 0.406: v55.88,80.01 59.69,83.82 69.85,83.82 71.12,82.55 v91.44,82.55 | v95.25,82.55 114.3,82.55 JP_NCHK_PLY1.2
NUNCHK_MODE_PLY2  (via drill 0.6)
  Top 0.406: U$2.PD3 33.02,78.74 v58.42,78.74 | v85.09,81.28 v95.25,91.44
  Bottom 0.406: v58.42,78.74 60.96,78.74 63.5,81.28 v85.09,81.28 | v95.25,91.44 102.87,91.44 102.87,96.52 109.22,102.87 114.3,102.87 JP_NCHK_PLY2.2
NUNCHK_MUX  (via drill 0.6)
  Top 0.406: v125.73,43.18 v125.73,40.64 | U$2.PD7 58.42,71.12 v58.42,57.15
  Bottom 0.406: v125.73,43.18 125.73,43.81 N-FET#3.2 N-FET#14.2 | v125.73,40.64 125.73,39.37 119.38,39.37 | 119.38,39.37 N-FET#2.2 | v58.42,57.15 58.42,50.8 60.96,48.26 109.22,48.26 110.49,46.99 110.49,40.64 111.76,39.37 119.38,39.37
NUNCHK_SCL_3.3V_PLY1
  Top 0.406: NUNCHK1.1 121.92,27.94 130.81,36.83 135.89,36.83 137.16,38.1 137.16,55.88 N-FET#4.1
NUNCHK_SCL_3.3V_PLY2
  Bottom 0.406: NUNCHK2.1 138.43,39.37 135.89,41.91 N-FET#3.1
NUNCHK_SCL_5V  (via drill 0.6)
  Top 0.406: N-FET#5.1 R11.1 66.04,62.23 62.23,66.04 62.23,80.01 59.69,82.55 v26.67,82.55
  Bottom 0.406: U$2.PC5 21.59,82.55 v26.67,82.55
NUNCHK_SDA_3.3V  (via drill 0.6)
  Top 0.406: v104.14,45.72 v104.14,60.96
  Bottom 0.406: N-FET#6.3 R14.1 91.44,62.23 92.71,60.96 v104.14,60.96 | NUNCHK2.2 140.97,21.59 139.7,20.32 139.7,19.05 127,19.05 124.46,21.59 NUNCHK1.2 124.46,31.75 119.38,36.83 111.76,36.83 104.14,44.45 v104.14,45.72
NUNCHK_SDA_5V
  Top 0.406: U$2.PC4 24.13,81.28 58.42,81.28 60.96,78.74 60.96,63.5 R12.1
  Bottom 0.406: N-FET#6.1 R12.1
QUARZ_ENABLE  (via drill 0.6)
  Top 0.406: v41.91,46.99 21.59,46.99 20.32,45.72 20.32,43.18 21.59,41.91 44.45,41.91 46.99,39.37 | 46.99,39.37 v63.5,39.37 | v76.2,24.13 90.17,24.13 U$3.ENABLE | U$1.PB7 46.99,39.37
  Bottom 0.406: U$3.ENABLE 97.79,26.67 C4.1 | U$2.PB7 44.45,76.2 41.91,73.66 41.91,58.42 40.64,57.15 40.64,52.07 41.91,50.8 v41.91,46.99 | v63.5,39.37 76.2,26.67 v76.2,24.13
QUARZ_OUTPUT  (via drill 0.6)
  Top 0.406: U$1.PB6 39.37,39.37 36.83,39.37 35.56,40.64 21.59,40.64 19.05,43.18 19.05,45.72 21.59,48.26 38.1,48.26 v39.37,49.53 | v102.87,39.37 102.87,35.56 105.41,33.02 C3.1
  Bottom 0.406: U$3.OUTPUT C3.1 | U$2.PB6 41.91,76.2 40.64,74.93 40.64,59.69 39.37,58.42 v39.37,49.53 | U$1.PB6 43.18,35.56 60.96,35.56 60.96,41.91 63.5,44.45 99.06,44.45 102.87,40.64 v102.87,39.37
RS232_[C-MODUL_TX]
  Bottom 0.406: U$1.PD0 24.13,35.56 22.86,34.29 20.32,34.29 19.05,35.56 19.05,68.58 26.67,76.2 U$2.PD1
RS232_[VGA-MODUL_TX]
  Bottom 0.406: U$1.PD1 26.67,34.29 24.13,31.75 20.32,31.75 17.78,34.29 17.78,69.85 22.86,74.93 24.13,74.93 U$2.PD0
RST_GAME
  Bottom 0.406: U$2.PD5 U$8.SIDE_B_#1 45.72,67.31 R22.1
SOUND_TRIGGER
  Bottom 0.406: JP4.1 29.21,59.69 30.48,60.96 30.48,72.39 34.29,76.2 U$2.PD4
VCC  (via drill 0.6)
  Top 0.406: v52.07,13.97 52.07,19.05 v53.34,20.32
  Bottom 0.406: C1.1 52.07,12.7 | 52.07,12.7 45.72,12.7 | 45.72,12.7 JP2.1 | 45.72,12.7 43.18,12.7 IC2.IN | IC1.IN C7.1 59.69,19.05 58.42,20.32 v53.34,20.32 | v52.07,13.97 52.07,12.7
VGA_BLAU
  Bottom 0.406: JP_BLAU.2 133.35,102.87 137.16,102.87 139.7,100.33 139.7,97.79 JP1.5
VGA_FARBE_BIT1  (via drill 0.6)
  Top 0.406: v125.73,71.12 v135.89,71.12
  Bottom 0.406: JP_BLAU.1 JP_GRÜN.1 JP_ROT.1 v135.89,71.12 | R18.2 49.53,64.77 50.8,66.04 120.65,66.04 v125.73,71.12
VGA_FARBE_BIT2
  Bottom 0.406: JP_BLAU.3 JP_GRÜN.3 JP_ROT.3 130.81,69.85 125.73,64.77 57.15,64.77 57.15,62.23 54.61,59.69 R19.2
VGA_GRÜN  (via drill 0.6)
  Top 0.406: v133.35,95.25 v139.7,95.25
  Bottom 0.406: JP_GRÜN.2 v133.35,95.25 | v139.7,95.25 JP1.4
VGA_HSYNC
  Top 0.406: JP1.1 142.24,87.63 140.97,86.36 140.97,85.09 139.7,83.82 139.7,78.74 137.16,76.2 125.73,76.2 121.92,72.39 107.95,72.39 92.71,57.15 87.63,57.15 63.5,33.02 31.75,33.02 29.21,35.56 U$1.PD2
VGA_ROT  (via drill 0.6)
  Top 0.406: v133.35,86.36 138.43,86.36 v138.43,87.63
  Bottom 0.406: JP_ROT.2 v133.35,86.36 | v138.43,87.63 138.43,92.71 JP1.3
VGA_VSYNC
  Top 0.406: JP1.2 140.97,90.17 139.7,88.9 139.7,85.09 138.43,83.82 138.43,78.74 137.16,77.47 124.46,77.47 120.65,73.66 106.68,73.66 92.71,59.69 87.63,59.69 62.23,34.29 33.02,34.29 31.75,35.56 U$1.PD3

### Text on the board
tNames: Für die korrekte Pinbelgeung / der Transistoren unbedingt / deren Datenblätter konsultieren | Jumper | Jumper | GND / GND / GND / Blau / Grün / Rot / VSync / HSync | Control-Modul | Ausgabe für optionalen / Tongenerator für Auftreffen / Ball<->Spielerbalken | VGA-Modul | Nunchuck: / SCL;SDA;3.3V;GND / Gelb;Grün;Rot;Weiß